# EAGLE schematic Resonant_Filter (EAGLE 7.6.0)
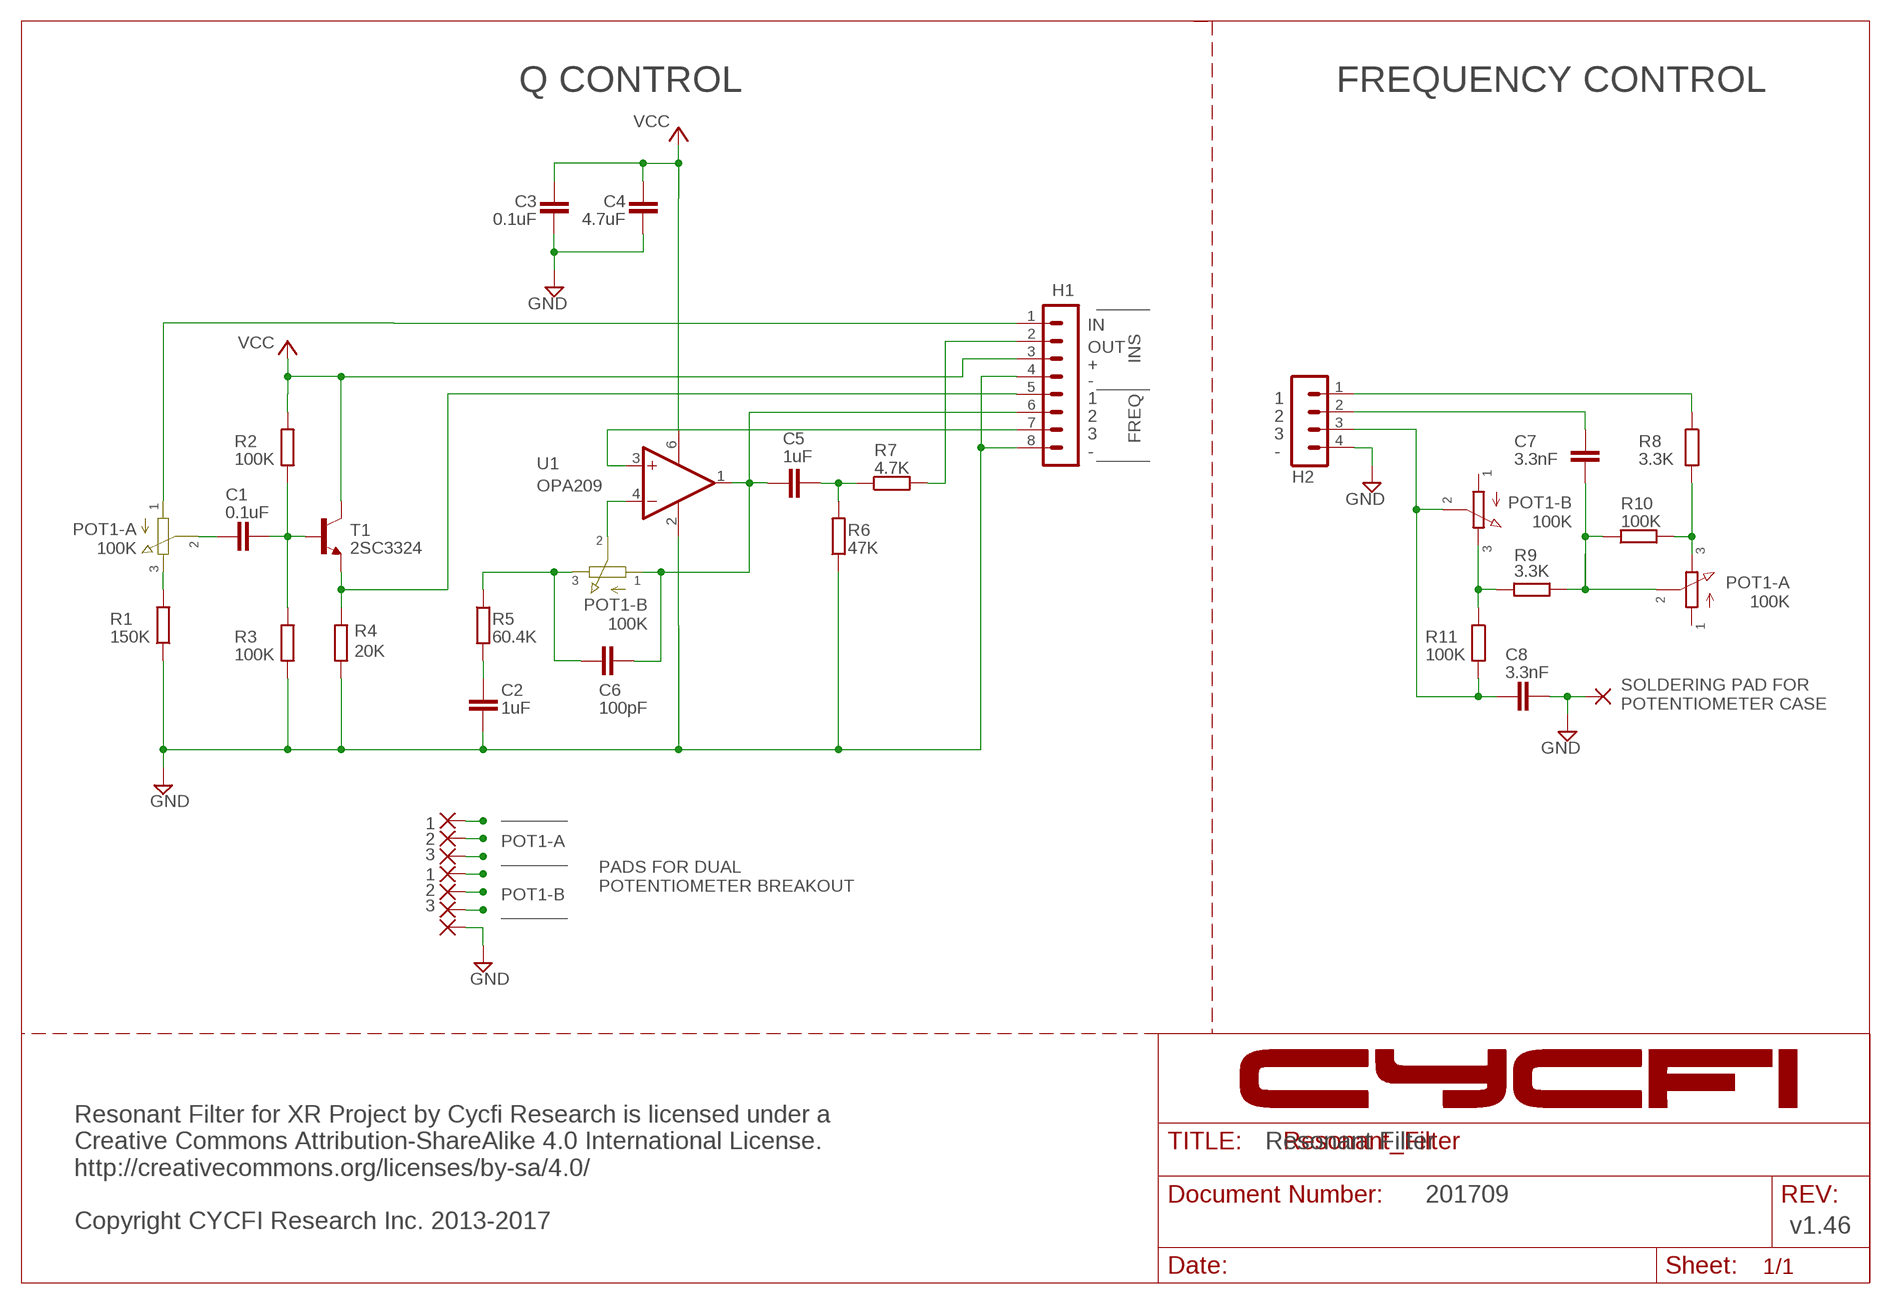
[diagram p0: schematic, sheet 1]

## Parts
C1  0.1uF  C-EUC0603  [C0603]
C2  1uF  C-EUC0805  [C0805]
C3  0.1uF  C-EUC0603  [C0603]
C4  4.7uF  C-EUC0603  [C0603]
C5  1uF  C-EUC0805  [C0805]
C6  100pF  C-EUC0805  [C0805]
C7  3.3nF  C-EUC0805  [C0805]
C8  3.3nF  C-EUC0805  [C0805]
H1  MA08-1  [MA08-1]
H2  MA04-1  [MA04-1]
PAD1  SMD2  [SMD1,27-2,54]
PAD2  SMD2  [SMD1,27-2,54]
PAD3  SMD2  [SMD1,27-2,54]
PAD4  SMD2  [SMD1,27-2,54]
PAD5  SMD2  [SMD1,27-2,54]
PAD6  SMD2  [SMD1,27-2,54]
PAD7  SMD2  [SMD1,27-2,54]
PAD8  1,6/0,9  [1,6/0,9]
POT1-A  PDB182-GTR02  [PDB182-GTR01]
R1  150K  R-EU_R0402  [R0402]
R2  100K  R-EU_R0402  [R0402]
R3  100K  R-EU_R0402  [R0402]
R4  20K  R-EU_R0402  [R0402]
R5  60.4K  R-EU_R0402  [R0402]
R6  47K  R-EU_R0402  [R0402]
R7  4.7K  R-EU_R0402  [R0402]
R8  3.3K  R-EU_R0603  [R0603]
R9  3.3K  R-EU_R0603  [R0603]
R10  100K  R-EU_R0402  [R0402]
R11  100K  R-EU_R0402  [R0402]
T1  2SC3324  BC846  [SOT23]
U1  OPA209  OPA836  [SOT23-6]

## Nets
1: H1.5 R4.2 T1.2(E)
2: C8.1 H2.3 POT1-A.B2 R11.2
3: H1.7 U1.3(+IN)
4: H2.1 R8.1
5: C7.2 H2.2
ASDADS: C5.1 R6.2 R7.1
BYP: H1.1 PAD1.1(P)
EQ: H1.2 R7.2
GND: C2.1 C3.1 C4.1 C8.2 H1.4 H1.8 H2.4 PAD7.1(P) PAD8.1(P) R1.1 R3.1 R4.1 R6.1 U1.2(V-)
INPUT: C1.1 PAD2.1(P)
N$1: POT1-A.A3 R8.2 R10.2
N$2: C7.1 POT1-A.A2 R9.1 R10.1
N$3: POT1-A.B3 R9.2 R11.1
N$4: C1.2 R2.1 R3.2 T1.1(B)
N$8: C2.2 R5.2
PA-3: PAD3.1(P) R1.2
PTB-1: C5.2 C6.2 H1.6 PAD5.1(P) U1.1(OUT)
PTB-2: PAD6.1(P) U1.4(-IN)
PTB-3: C6.1 PAD4.1(P) R5.1
VIN: C3.2 C4.2 H1.3 R2.2 T1.3(C) U1.6(V+) ; supply symbol labelled VCC
Unconnected: POT1-A.A1 POT1-A.B1

## Notes on the sheet
- Q CONTROL | FREQUENCY CONTROL
- IN
- OUT
- + | INS
- -
- 1 | 1
- 2 | 2
- 3 | 3
- - | FREQ | -
- 1
- POT1-A
  100K
- POT1-B
  100K
- 2
- 2
- 3
- 3 | 1
- POT1-A
  100K
- POT1-B
  100K
- SOLDERING PAD FOR 
  POTENTIOMETER CASE
- 1
- 2 | POT1-A
- 3
- 1
- PADS FOR DUAL 
  POTENTIOMETER BREAKOUT
- 2 | POT1-B
- 3
- Resonant Filter
- 201709
- Resonant Filter for XR Project by Cycfi Research is licensed under a
  Creative Commons Attribution-ShareAlike 4.0 International License.
  http://creativecommons.org/licenses/by-sa/4.0/
  
  Copyright CYCFI Research Inc. 2013-2017
- v1.46

## Library data of the parts
C1-C8 = resistor:C-EU: CAPACITOR, European symbol
H1 = con-lstb:MA08-1: PIN HEADER; OC_FARNELL: unknown; OC_NEWARK: unknown
H2 = con-lstb:MA04-1: PIN HEADER; OC_FARNELL: unknown; OC_NEWARK: unknown
PAD1-PAD7 = wirepad:SMD2: SMD PAD
PAD8 = wirepad:1,6/0,9: THROUGH-HOLE PAD
POT1-A = CYCFI_Passive:PDB182-GTR02
R1-R11 = resistor:R-EU_: RESISTOR, European symbol
T1 = transistor:BC846: NPN TRANSISTOR
U1 = CYCFI:OPA836: OPA836 Single amplifier